# EAGLE design Controller (EAGLE 9.6.2)
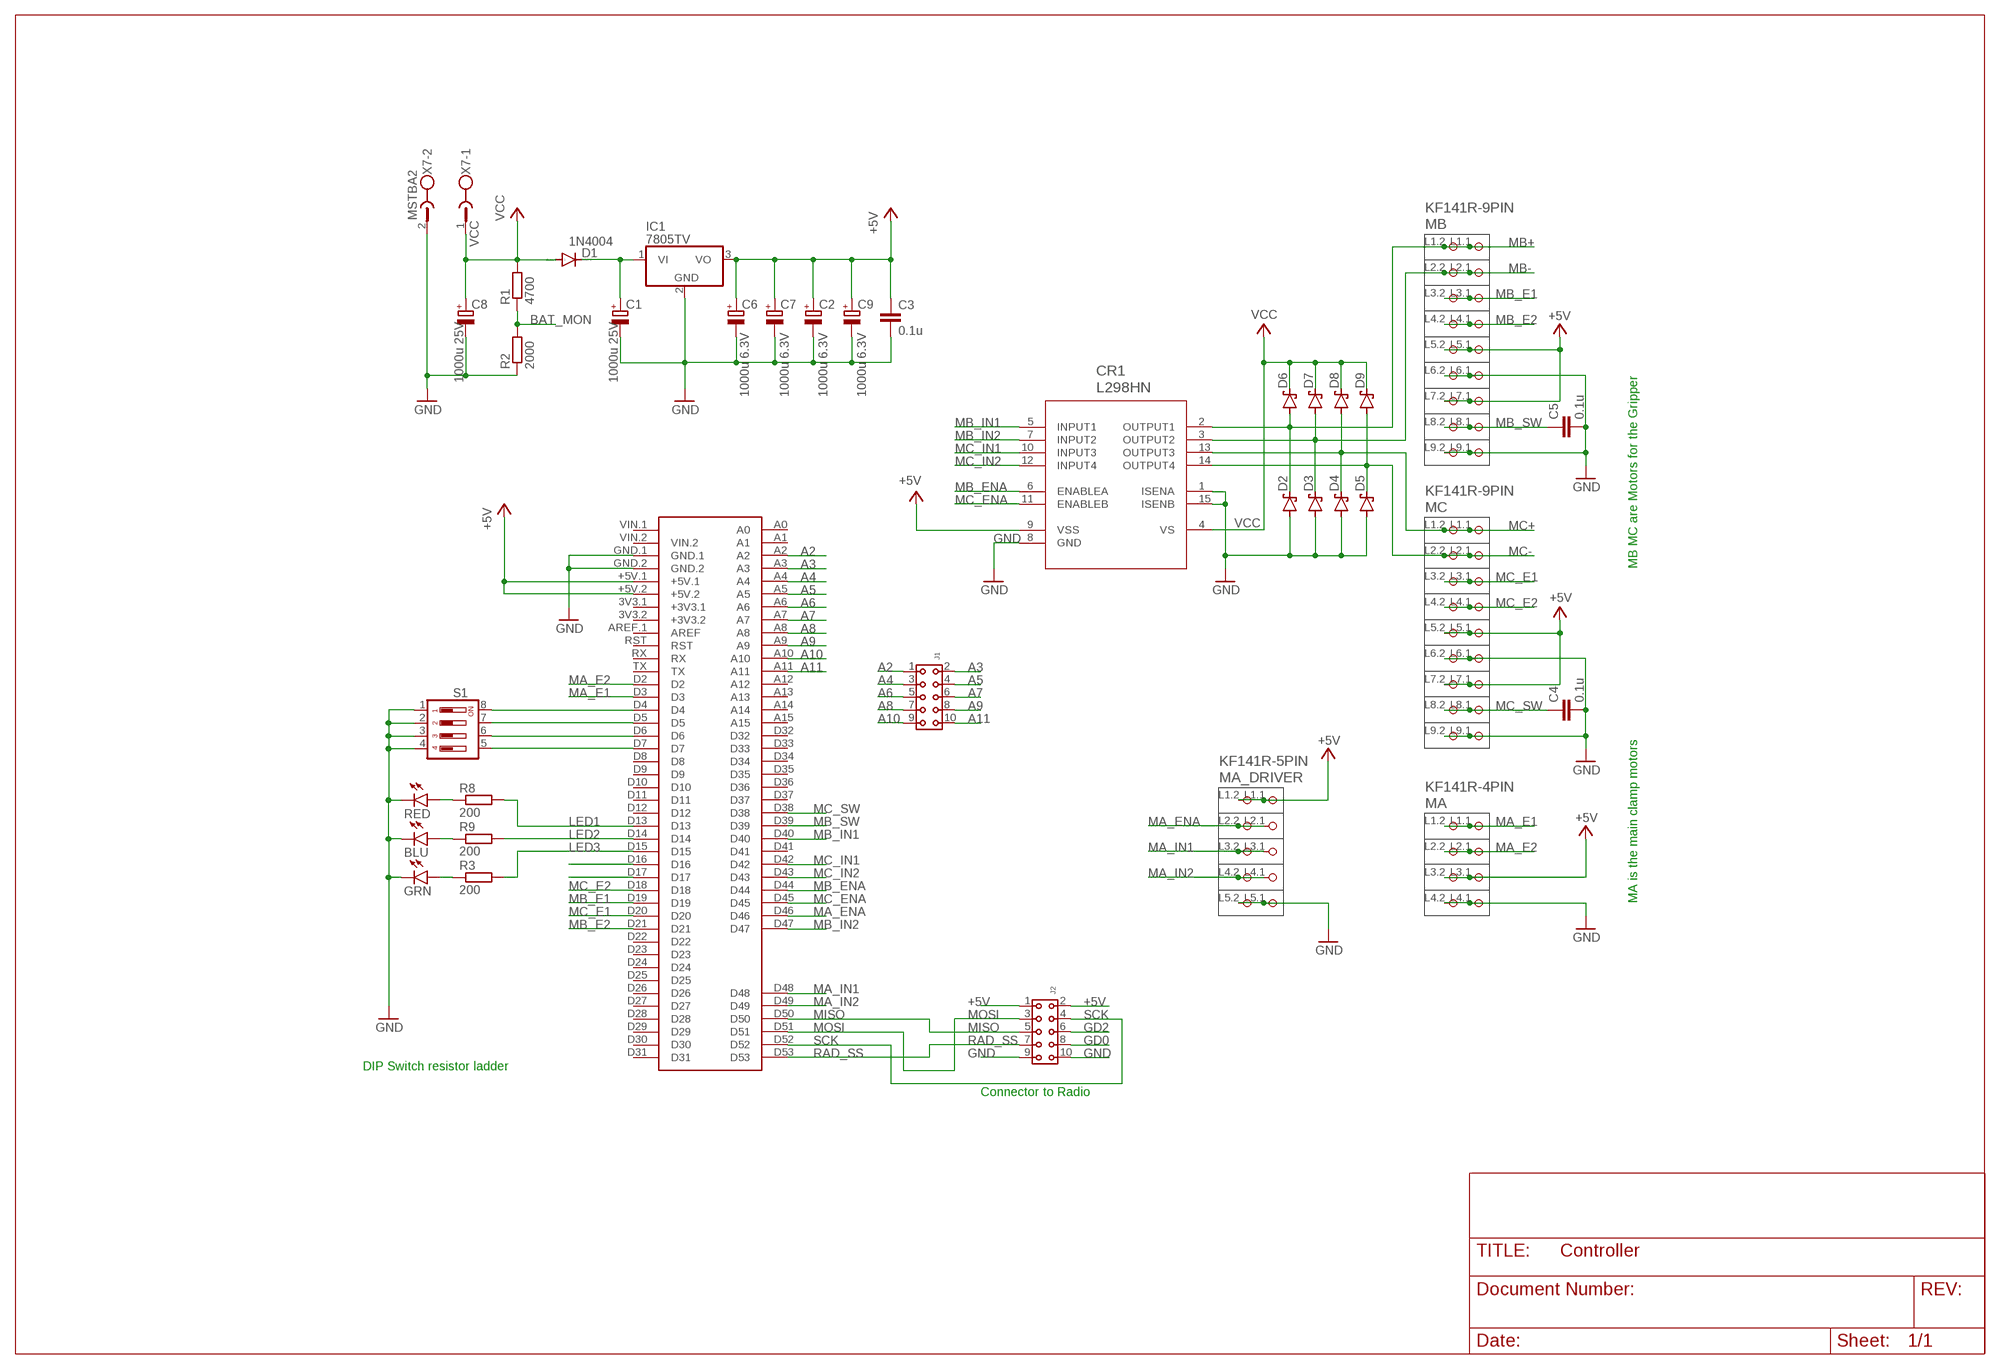
[diagram p0: schematic, sheet 1]

## Parts
BLU  LED5MM  [LED5MM]
C1  1000u 25V  CPOL-EUE3.5-10  [E3,5-10]
C2  1000u 6.3V  CPOL-EU  [E4-8-13HORI]
C3  0.1u  C-EU050-030X075  [C050-030X075]
C4  0.1u  C-EU050-030X075  [C050-030X075]
C5  0.1u  C-EU050-030X075  [C050-030X075]
C6  1000u 6.3V  CPOL-EU  [E4-8-13HORI]
C7  1000u 6.3V  CPOL-EU  [E4-8-13HORI]
C8  1000u 25V  CPOL-EUE3.5-10  [E3,5-10]
C9  1000u 6.3V  CPOL-EU  [E4-8-13HORI]
CR1  L298HN  [MULTIWATT15_H_STM]
D1  1N4004  [DO41-10]
D2  1N5819-B  [DO41-7.6]
D3  1N5819-B  [DO41-7.6]
D4  1N5819-B  [DO41-7.6]
D5  1N5819-B  [DO41-7.6]
D6  1N5819-B  [DO41-7.6]
D7  1N5819-B  [DO41-7.6]
D8  1N5819-B  [DO41-7.6]
D9  1N5819-B  [DO41-7.6]
GRN  LED5MM  [LED5MM]
IC1  7805TV  [TO220V]
J1  6130XX21821_61301021821  [61301021821]
J2  6130XX21821_61301021821  [61301021821]
MA  KF141R-4PIN  [KF141R-4PIN]
MA_DRIVER  KF141R-5PIN  [KF141R-5PIN]
MB  KF141R-9PIN  [KF141R-9PIN]
MC  KF141R-9PIN  [KF141R-9PIN]
R1  4700  R-EU_0207/7  [0207/7]
R2  2000  R-EU_0207/7  [0207/7]
R3  200  R-EU_0207/7  [0207/7]
R8  200  R-EU_0207/7  [0207/7]
R9  200  R-EU_0207/7  [0207/7]
RED  LED5MM  [LED5MM]
S1  DIP04YL  [DIP04YL]
U$1  MEGA2560_MIKRO  [MEGA2560_MIKRO]
X7  MSTBA2  [MSTBA2]

## Nets
+5V: C2.+ C3.1 C6.+ C7.+ C9.+ CR1.9(VSS) IC1.3(VO) J2.1 J2.2 MA.L3.1(P3.1) MA.L3.2(P3.2) MA_DRIVER.L1.1(P1.1) MA_DRIVER.L1.2(P1.2) MB.L5.1(P5.1) MB.L5.2(P5.2) MB.L7.1(P7.1) MB.L7.2(P7.2) MC.L5.1(P5.1) MC.L5.2(P5.2) MC.L7.1(P7.1) MC.L7.2(P7.2) U$1.+5V.1 U$1.+5V.2
A2: J1.1 U$1.A2
A3: J1.2 U$1.A3
A4: J1.3 U$1.A4
A5: J1.4 U$1.A5
A6: J1.5 U$1.A6
A7: J1.6 U$1.A7
A8: J1.7 U$1.A8
A9: J1.8 U$1.A9
A10: J1.9 U$1.A10
A11: J1.10 U$1.A11
BAT_MON: R1.1 R2.2
GD0: J2.8
GD2: J2.6
GND: BLU.K(C) C1.- C2.- C3.2 C4.2 C5.2 C6.- C7.- C8.- C9.- CR1.1(ISENA) CR1.8(GND) CR1.15(ISENB) D2.A D3.A D4.A D5.A GRN.K(C) IC1.2(GND) J2.9 J2.10 MA.L4.1(P4.1) MA.L4.2(P4.2) MA_DRIVER.L5.1(P5.1) MA_DRIVER.L5.2(P5.2) MB.L6.1(P6.1) MB.L6.2(P6.2) MB.L9.1(P9.1) MB.L9.2(P9.2) MC.L6.1(P6.1) MC.L6.2(P6.2) MC.L9.1(P9.1) MC.L9.2(P9.2) R2.1 RED.K(C) S1.1 S1.2 S1.3 S1.4 U$1.GND.1 U$1.GND.2 X7.2
LED1: R8.2 U$1.D13
LED2: R9.2 U$1.D14
LED3: R3.2 U$1.D15
MA_E1: MA.L1.1(P1.1) MA.L1.2(P1.2) U$1.D3
MA_E2: MA.L2.1(P2.1) MA.L2.2(P2.2) U$1.D2
MA_ENA: MA_DRIVER.L2.1(P2.1) MA_DRIVER.L2.2(P2.2) U$1.D46
MA_IN1: MA_DRIVER.L3.1(P3.1) MA_DRIVER.L3.2(P3.2) U$1.D48
MA_IN2: MA_DRIVER.L4.1(P4.1) MA_DRIVER.L4.2(P4.2) U$1.D49
MB+: CR1.2(OUTPUT1) D2.C D6.A MB.L1.1(P1.1) MB.L1.2(P1.2)
MB-: CR1.3(OUTPUT2) D3.C D7.A MB.L2.1(P2.1) MB.L2.2(P2.2)
MB_E1: MB.L3.1(P3.1) MB.L3.2(P3.2) U$1.D19
MB_E2: MB.L4.1(P4.1) MB.L4.2(P4.2) U$1.D21
MB_ENA: CR1.6(ENABLEA) U$1.D44
MB_IN1: CR1.5(INPUT1) U$1.D40
MB_IN2: CR1.7(INPUT2) U$1.D47
MB_SW: C5.1 MB.L8.1(P8.1) MB.L8.2(P8.2) U$1.D39
MC+: CR1.13(OUTPUT3) D4.C D8.A MC.L1.1(P1.1) MC.L1.2(P1.2)
MC-: CR1.14(OUTPUT4) D5.C D9.A MC.L2.1(P2.1) MC.L2.2(P2.2)
MC_E1: MC.L3.1(P3.1) MC.L3.2(P3.2) U$1.D20
MC_E2: MC.L4.1(P4.1) MC.L4.2(P4.2) U$1.D18
MC_ENA: CR1.11(ENABLEB) U$1.D45
MC_IN1: CR1.10(INPUT3) U$1.D42
MC_IN2: CR1.12(INPUT4) U$1.D43
MC_SW: C4.1 MC.L8.1(P8.1) MC.L8.2(P8.2) U$1.D38
MISO: J2.5 U$1.D50
MOSI: J2.3 U$1.D51
N$1: U$1.D16
N$3: C1.+ D1.C IC1.1(VI)
N$4: U$1.D17
N$5: R8.1 RED.A
N$6: BLU.A R9.1
N$8: GRN.A R3.1
N$12: S1.8 U$1.D4
N$13: S1.7 U$1.D5
N$15: S1.6 U$1.D6
N$18: S1.5 U$1.D7
RAD_SS: J2.7 U$1.D53
SCK: J2.4 U$1.D52
VCC: C8.+ CR1.4(VS) D1.A D6.C D7.C D8.C D9.C R1.2 X7.1
Unconnected: U$1.3V3.1(+3V3.1) U$1.3V3.2(+3V3.2) U$1.A0 U$1.A1 U$1.A12 U$1.A13 U$1.A14 U$1.A15 U$1.AREF.1(AREF) U$1.D8 U$1.D9 U$1.D10 U$1.D11 U$1.D12 U$1.D22 U$1.D23 U$1.D24 U$1.D25 U$1.D26 U$1.D27 U$1.D28 U$1.D29 U$1.D30 U$1.D31 U$1.D32 U$1.D33 U$1.D34 U$1.D35 U$1.D36 U$1.D37 U$1.D41 U$1.RST U$1.RX U$1.TX U$1.VIN.1 U$1.VIN.2

## Notes on the sheet
- MB MC are Motors for the Gripper
- MA is the main clamp motors
- DIP Switch resistor ladder
- Connector to Radio

## Library data of the parts
BLU GRN RED = led:LED: LED OSRAM: - CHIPLED LG R971, LG N971, LY N971, LG Q971, LY Q971, LO R971, LY R971 LH N974, LH R974 LS Q976, LO Q976, LY Q976 LO Q996 - Hyper CHIPLED LW Q18S LB Q993, LB Q99A, LB R99A - SideLED LS A670, LO A670, LY A670, LG A670, LP A670 LB A673, LV A673, LT A673, LW A673 LH A674 LY A675 LS A676, LA A676, LO A676, LY A676, LW A676 LS A679, LY A679, LG A679 - Hyper Micro SIDELED® LS Y876, LA Y876, LO Y876, LY Y876 LT Y87S - SmartLED LW L88C, LW L88S LB L89C, LB L89S, LG L890 LS L89K, LO L89K, LY L89K LS L896, LA L896, LO L896, LY L896 - TOPLED LS T670, LO T670, LY T670, LG T670, LP T670 LSG T670, LSP T670, LSY T670, LOP T670, LYG T670 LG T671, LOG T671, LSG T671 LB T673, LV T673, LT T673, LW T673 LH T674 LS T676, LA T676, LO T676, LY T676, LB T676, LH T676, LSB T676, LW T676 LB T67C, LV T67C, LT T67C, LS T67K, LO T67K, LY T67K, LW E67C LS E67B, LA E67B, LO E67B, LY E67B, LB E67C, LV E67C, LT E67C LW T67C LS T679, LY T679, LG T679 LS T770, LO T770, LY T770, LG T770, LP T770 LB T773, LV T773, LT T773, LW T773 LH T774 LS E675, LA E675, LY E675, LS T675 LS T776, LA T776, LO T776, LY T776, LB T776 LHGB T686 LT T68C, LB T68C - Hyper Mini TOPLED® LB M676 - Mini TOPLED Santana® LG M470 LS M47K, LO M47K, LY M47K Source: http://www.osram.convergy.de LUXEON: - LUMILED® LXK2-PW12-R00, LXK2-PW12-S00, LXK2-PW14-U00, LXK2-PW14-V00 LXK2-PM12-R00, LXK2-PM12-S00, LXK2-PM14-U00 LXK2-PE12-Q00, LXK2-PE12-R00, LXK2-PE12-S00, LXK2-PE14-T00, LXK2-PE14-U00 LXK2-PB12-K00, LXK2-PB12-L00, LXK2-PB12-M00, LXK2-PB14-N00, LXK2-PB14-P00, LXK2-PB14-Q00 LXK2-PR12-L00, LXK2-PR12-M00, LXK2-PR14-Q00, LXK2-PR14-R00 LXK2-PD12-Q00, LXK2-PD12-R00, LXK2-PD12-S00 LXK2-PH12-R00, LXK2-PH12-S00 LXK2-PL12-P00, LXK2-PL12-Q00, LXK2-PL12-R00 Source: www.luxeon.com KINGBRIGHT: KA-3528ASYC Source: www.kingbright.com
C1 C8 = resistor:CPOL-EU: POLARIZED CAPACITOR, European symbol
C2 C6 C7 C9 = diy-rcdevices:CPOL-EU: POLARIZED CAPACITOR, European symbol
C3-C5 = rcl:C-EU: CAPACITOR, European symbol; SPICEPREFIX: C
CR1 = L298HN:L298HN; BUILT_BY: EMA_UL_Team; MANUFACTURER_PART_NUMBER: L298HN; SOURCELIBRARY: Updates_to_database_2020-11-02; VENDOR: STMicroelectronics
D1 = diode:1N4004: DIODE general purpose rectifier, 1 A
D2-D9 = diode:1N581*: 1.0A SCHOTTKY BARRIER RECTIFIER Source: http://www.diodes.com/datasheets/ds23001.pdf
IC1 = linear:78*: Positive VOLTAGE REGULATOR Source: http://cache.national.com/ds/LM/LM78L05.pdf http://www.fairchildsemi.com/ds/LM/LM7805.pdf
J1 J2 = Wurth_Connectors_WR-PHD:6130XX21821_61301021821: WR-PHD 2.54 mm Dual Socket Header ARTICLE PROPERTIES: Pins:4;​ 6;​ 8;​ 10;​ 12;​ 14;​ 16;​ 18;​ 20;​ 22;​ 24;​ 26;​ 28;​ 30;​ 32;​ 34;​ 36;​ 40;​ 44;​ 64;​ 72 KIND PROPERTIES: Pitch：2.54 mm Quality Class:3 as per CECC 75 301-802 Rows：Dual Gender：Socket Header Type：Straight MATERIAL PROPERTIES: Insulator Material :PBT Insulator Flammability Rating:UL94 V-0 Contact Material:Copper Alloy Contact Plating:Gold Contact Type:Stamped GENERAL INFORMATION Operating Temperature:-40 up to +125 °C Compliance:Lead free / RoHS ELECTRICAL PROPERTIES: Rated Current:3 A IR 1:3 A Withstanding Voltage:500 V (AC) Contact Resistance:20 mΩ RISO:1000 MΩ CERTIFICATION UL Approval:E323964 PACKAGING PROPERTIES Packaging:Tray <https://katalog.we-online.com/media/images/v2/o57948v209%20Family_Dual_Socket_Header_WR-PHD_6130xx21821.jpg> Details see: https://katalog.we-online.com/en/em/PHD_2_54_DUAL_SOCKET_HEADER_6130XX21821 Updated by Yingchun,Shan 2019-10-21 2019 (C) Würth Elektronik; DATASHEET-URL: https://katalog.we-online.com/em/datasheet/61301021821.pdf; GENDER: Socket Header; IR: 3A; MATES: WR-PHD 2.54mm SMT Dual Pin Header/THT Angled Dual Pin Header/THT Dual Board Stacker/THT Dual Pin Header; PACKAGING: Tray; PART-NUMBER: 61301021821; PINS: 10; ROWS: Dual; TYPE: Straight
MA = diy_connector:KF141R-4PIN
MA_DRIVER = diy_connector:KF141R-5PIN
MB MC = diy_connector:KF141R-9PIN: Serie 236, Klemmenleiste für Leiterplatten 2 Lötstifte/Pol / Series 236, PCB terminal strip 2 solder pins/pole Polzahl / Pole No.: 3 Rastermaß / Pitch: 5.08 mm Bemessungsspannung / Rated Voltage: 320 V Nennstrom / Nominal Current: 24 A Leiterquerschnitt / Conductor Size: 0.08 - 2.5 mm² Anschlusstechnik / Connection Technology: CAGE CLAMP® Lötstiftlänge: / Solder Pin Length: 4 mm Leitereinführung (zur Platine) / Conductor entry angle (to PCB): 45 ° Farbe / Color: grau / gray Stand: 01.01.2012. Die jeweils aktuellen Daten zu diesem Artikel finden Sie in unserem Produktkatalog, den Sie unter www.wago.com einsehen können. As of: 01/01/2012. Please find the newest data for this article in our product catalogue, which can be viewed under www.wago.com.
R1-R3 R8 R9 = resistor:R-EU_: RESISTOR, European symbol
S1 = switch-dil:DIP04YL: DIL/CODE SWITCH; OC_FARNELL: unknown; OC_NEWARK: unknown
U$1 = MIKRO_MEGA2560:MEGA2560_MIKRO: Arduino Mega2560 pro robotDyn, create by mikroavr.com
X7 = con-phoenix-508:MSTBA2: PHOENIX; MF: FARNELL; MPN: 1757242; OC_FARNELL: 3705171; OC_NEWARK: 71C4161

## Board
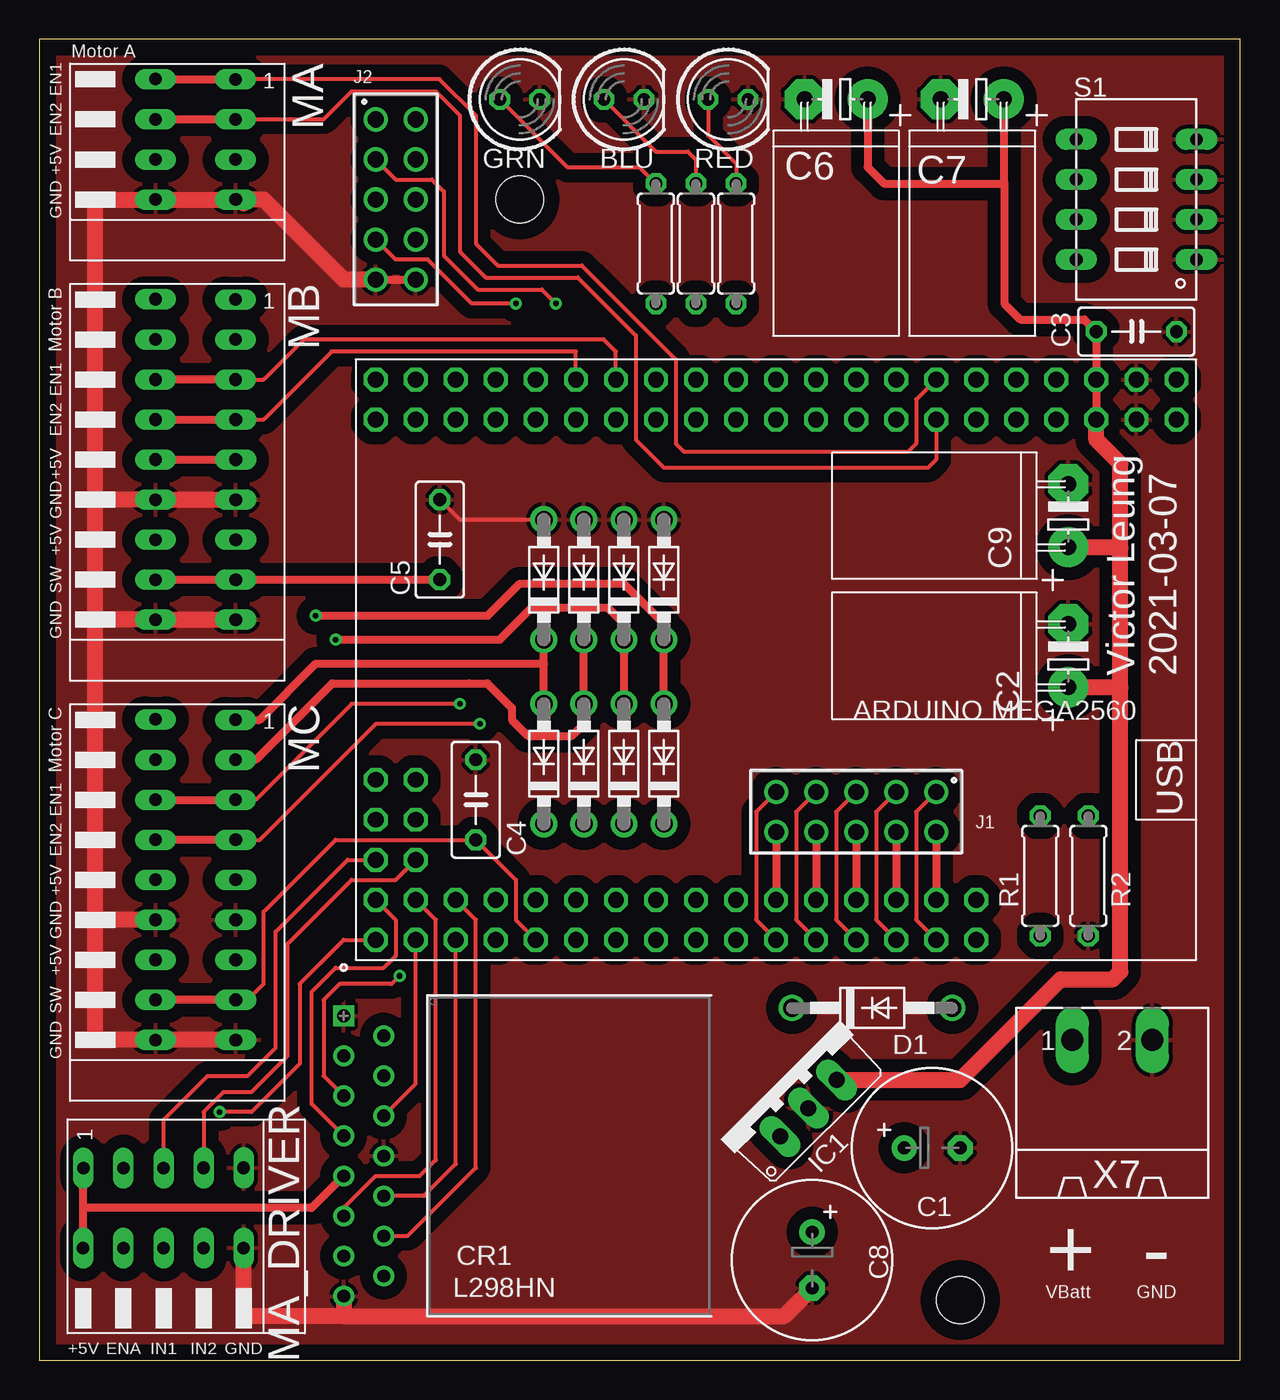
[diagram p1: board, top side]
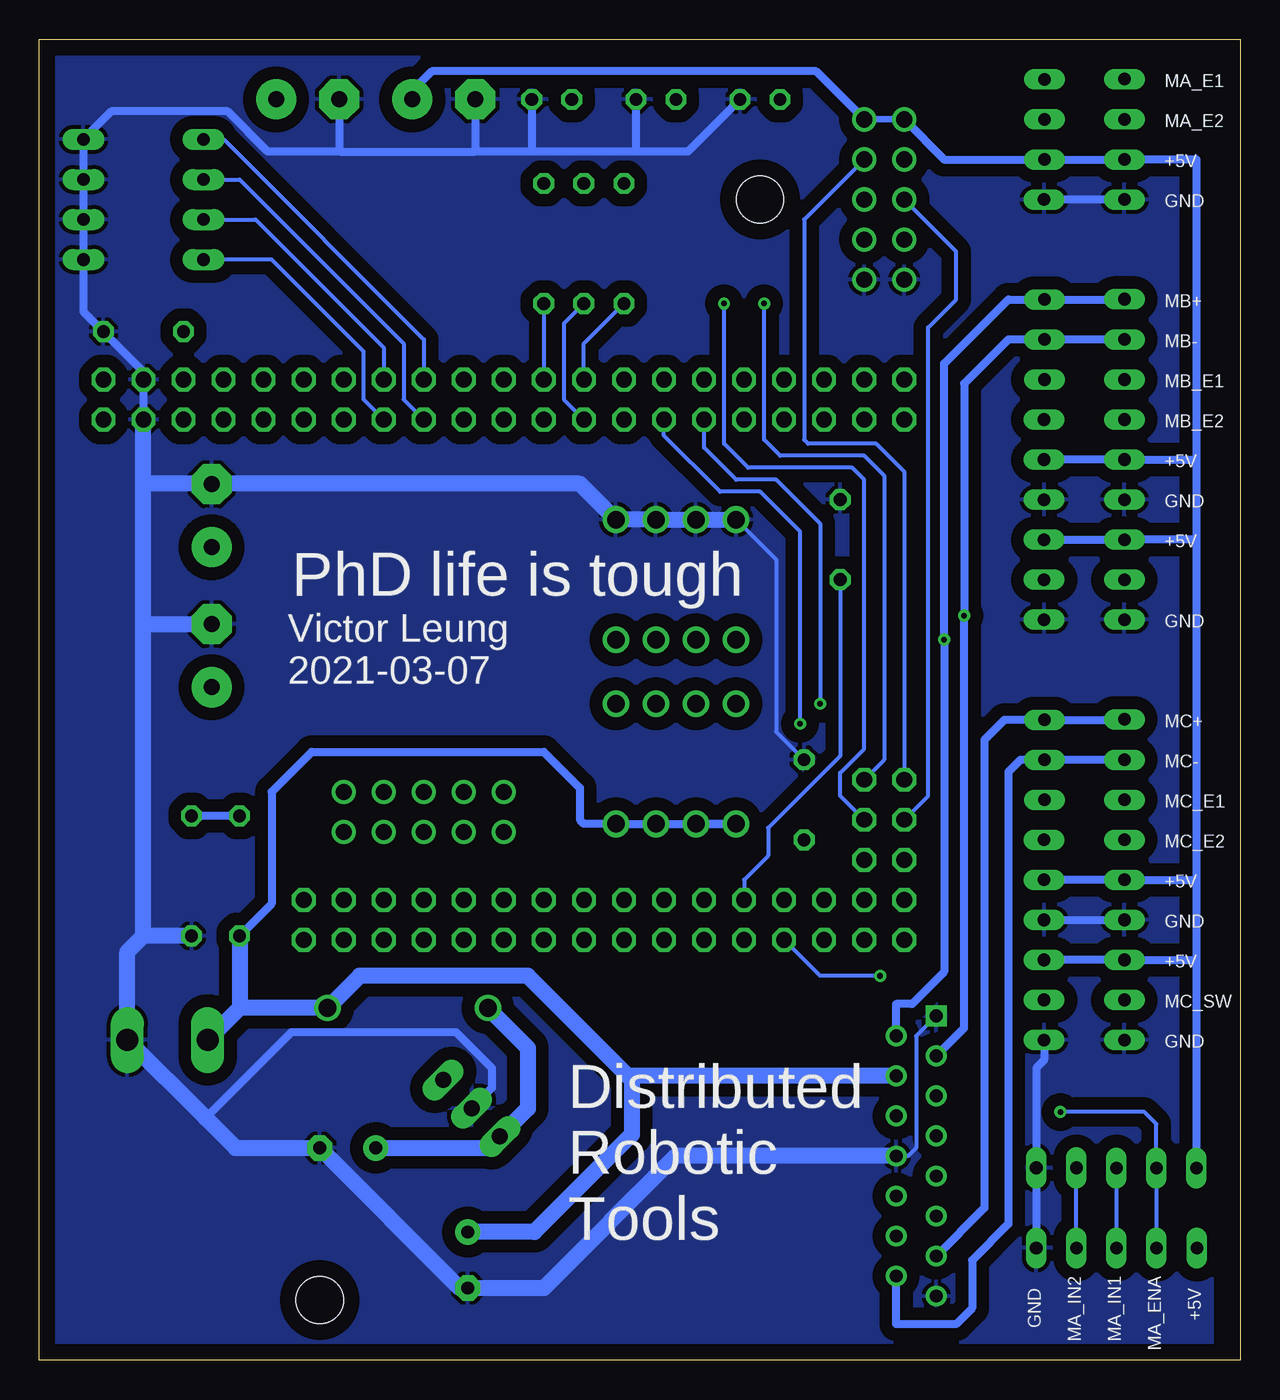
[diagram p2: board, bottom side, seen from below]

Size 76.2 x 83.82 mm. Coordinates in mm from the lower left corner, seen from the top.
Outline: 0,0 76.2,0 76.2,83.82 0,83.82 0,0
Copper layers (1*16): Top 0.035mm / dielectric 1.5mm / Bottom 0.035mm
Design rules "default": minimum track width 6mil, minimum drill 0.35mm, track to track 6mil, track to pad 6mil, pad to pad 6mil, via to via 6mil, smd to smd 6mil, copper to edge 40mil, drill to drill 6mil, minimum pad ring 10mil, minimum via ring 8mil, stop-mask expansion 4mil, vias tented up to drill 0mil, thermal gap 10mil
Holes 3 mm at 30.48,73.66 58.42,3.81

### Footprints (pad centres in the part's own frame; a part is rotated, then mirrored left to right if it is on the bottom)
LED5MM = drill 0.813 octagon: A -1.27,0; K 1.27,0
E3,5-10 = drill 0.813 pad 1.6: + -1.778,0 | drill 0.813 pad 1.6 octagon: - 1.778,0
E4-8-13HORI = drill 1.016 pad 2.54: + -2,0 | drill 1.016 pad 2.54 octagon: - 2,0
C050-030X075 = drill 0.813 octagon: 1 -2.54,0; 2 2.54,0
MULTIWATT15_H_STM = drill 0.813 pad 1.321 square: 1 0,0 | drill 0.813 pad 1.321: 2 1.27,2.54; 3 2.54,0; 4 3.81,2.54; 5 5.08,0; 6 6.35,2.54; 7 7.62,0; 8 8.89,2.54; 9 10.16,0; 10 11.43,2.54; 11 12.7,0; 12 13.97,2.54; 13 15.24,0; 14 16.51,2.54; 15 17.78,0
DO41-10 = drill 1.118: A 5.08,0; C -5.08,0
DO41-7.6 = drill 1.1 pad 1.7: A 3.81,0; C -3.81,0
TO220V = drill 1.016 long: 1 -2.54,-2.54; 2 0,-2.54; 3 2.54,-2.54
61301021821 = drill 1.02: 1 -5.08,-1.27; 2 -5.08,1.27; 3 -2.54,-1.27; 4 -2.54,1.27; 5 0,-1.27; 6 0,1.27; 7 2.54,-1.27; 8 2.54,1.27; 9 5.08,-1.27; 10 5.08,1.27
KF141R-4PIN = drill 0.8 long: L1.1 0,0; L1.2 -5.08,0.024; L2.1 0,-2.54; L2.2 -5.08,-2.54; L3.1 0,-5.08; L3.2 -5.08,-5.08; L4.1 0.009,-7.62; L4.2 -5.08,-7.62
KF141R-5PIN = drill 0.8 long: L1.1 0,0; L1.2 -5.08,0.024; L2.1 0,-2.54; L2.2 -5.08,-2.54; L3.1 0,-5.08; L3.2 -5.08,-5.08; L4.1 0.009,-7.62; L4.2 -5.08,-7.62; L5.1 0.009,-10.16; L5.2 -5.08,-10.16
KF141R-9PIN = drill 0.8 long: L1.1 0,0; L1.2 -5.08,0.024; L2.1 0,-2.54; L2.2 -5.08,-2.54; L3.1 0,-5.08; L3.2 -5.08,-5.08; L4.1 0.009,-7.62; L4.2 -5.08,-7.62; L5.1 0.009,-10.16; L5.2 -5.08,-10.16; L6.1 0.009,-12.7; L6.2 -5.08,-12.7; L7.1 0.009,-15.24; L7.2 -5.08,-15.24; L8.1 0.009,-17.78; L8.2 -5.08,-17.78; L9.1 0.009,-20.32; L9.2 -5.08,-20.32
0207/7 = drill 0.813 octagon: 1 -3.81,0; 2 3.81,0
DIP04YL = drill 0.813 long: 1 -3.81,-3.81; 2 -1.27,-3.81; 3 1.27,-3.81; 4 3.81,-3.81; 5 3.81,3.81; 6 1.27,3.81; 7 -1.27,3.81; 8 -3.81,3.81
MEGA2560_MIKRO = drill 1 octagon: 3V3.1 -26.67,-17.78; 3V3.2 -26.67,-20.32; +5V.1 -29.21,-17.78; +5V.2 -29.21,-20.32; A0 -21.59,15.24; A1 -21.59,12.7; A2 -19.05,15.24; A3 -19.05,12.7; A4 -16.51,15.24; A5 -16.51,12.7; A6 -13.97,15.24; A7 -13.97,12.7; A8 -11.43,15.24; A9 -11.43,12.7; A10 -8.89,15.24; A11 -8.89,12.7; A12 -6.35,15.24; A13 -6.35,12.7; A14 -3.81,15.24; A15 -3.81,12.7; AREF.1 -24.13,-17.78; D2 -19.05,-17.78; D3 -19.05,-20.32; D4 -16.51,-17.78; D5 -16.51,-20.32; D6 -13.97,-17.78; D7 -13.97,-20.32; D8 -11.43,-17.78; D9 -11.43,-20.32; D10 -8.89,-17.78; D11 -8.89,-20.32; D12 -6.35,-17.78; D13 -6.35,-20.32; D14 -3.81,-17.78; D15 -3.81,-20.32; D16 -1.27,-17.78; D17 -1.27,-20.32; D18 1.27,-17.78; D19 1.27,-20.32; D20 3.81,-17.78; D21 3.81,-20.32; D22 6.35,-17.78; D23 6.35,-20.32; D24 8.89,-17.78; D25 8.89,-20.32; D26 11.43,-17.78; D27 11.43,-20.32; D28 13.97,-17.78; D29 13.97,-20.32; D30 16.51,-17.78; D31 16.51,-20.32; D32 -1.27,15.24; D33 -1.27,12.7; D34 1.27,15.24; D35 1.27,12.7; D36 3.81,15.24; D37 3.81,12.7; D38 6.35,15.24; D39 6.35,12.7; D40 8.89,15.24; D41 8.89,12.7; D42 11.43,15.24; D43 11.43,12.7; D44 13.97,15.24; D45 13.97,12.7; D46 16.51,15.24; D47 16.51,12.7; D48 16.51,10.16; D49 13.97,10.16; D50 16.51,7.62; D51 13.97,7.62; D52 16.51,5.08; D53 13.97,5.08; GND.1 -31.75,-17.78; GND.2 -31.75,-20.32; RST -24.13,-20.32; RX -21.59,-17.78; TX -21.59,-20.32; VIN.1 -34.29,-17.78; VIN.2 -34.29,-20.32
MSTBA2 = drill 1.397 long: 1 -2.54,5.08; 2 2.54,5.08

### Placement (x,y rotation side)
BLU  37.08,80.01 0 top
C1  56.64,13.46 0 top
C2  65.28,44.7 90 top
C3  69.6,65.28 0 top
C4  27.69,35.56 90 top
C5  25.4,52.07 90 top
C6  50.55,80.01 180 top
C7  59.18,80.01 180 top
C8  49.02,6.35 270 top
C9  65.28,53.59 90 top
CR1  19.3,21.84 270 top
D1  52.83,22.35 0 top
D2  37.08,49.53 90 top
D3  39.62,49.53 90 top
D4  32,49.53 90 top
D5  34.54,49.53 90 top
D6  37.08,37.85 90 top
D7  39.62,37.85 90 top
D8  32,37.85 90 top
D9  34.54,37.85 90 top
GRN  30.48,80.01 0 top
IC1  46.99,17.78 45 top
J1  51.82,34.8 180 top
J2  22.61,73.66 270 top
MA  12.45,81.28 0 top
MA_DRIVER  2.79,12.19 90 top
MB  12.45,67.31 0 top
MC  12.45,40.64 0 top
R1  63.5,30.73 270 top
R2  66.55,30.73 90 top
R3  39.12,70.87 270 top
R8  44.2,70.87 270 top
R9  41.66,70.87 270 top
RED  43.69,80.01 0 top
S1  69.6,73.66 90 top
U$1  37.85,41.91 180 top
X7  68.07,15.24 0 top

### Tracks (layer width: path | path; a pad name or v marks a point on that pad's centre or on a via)
+5V
  Top 0.508: MB.L5.2 12.45,57.15 | MA_DRIVER.L1.2 2.77,9.65 | 2.77,9.65 2.77,12.17 MA_DRIVER.L1.1 | C6.+ 52.55,75.72 53.59,74.68 61.21,74.68 | 61.21,74.68 61.21,67.06 62.23,66.04 66.29,66.04 C3.1 U$1.+5V.2 U$1.+5V.1 | 61.21,74.68 61.21,79.98 C7.+ | CR1.9 17.27,9.65 2.77,9.65
  Top 1.016: IC1.3 58.42,17.78 64.8,24.16 68.1,24.16 68.58,24.64 68.58,42.67 | 68.58,42.67 68.58,51.56 | 68.58,51.56 68.58,56.9 67.06,58.42 U$1.+5V.1 | C9.+ 68.55,51.59 68.58,51.56 | C2.+ 68.55,42.7 68.58,42.67
  Bottom 0.406: J2.1 J2.2
  Bottom 0.508: 2.79,25.4 MC.L7.2 MC.L7.1 | 2.79,25.4 MA_DRIVER.L1.1 | 2.79,57.15 MB.L5.2 MB.L5.1 | 2.79,57.15 2.79,76.2 MA.L3.2 MA.L3.1 18.8,76.2 J2.1 | MB.L7.1 MB.L7.2 2.79,52.07 | MC.L5.1 MC.L5.2 2.79,30.48 | 2.79,57.15 2.79,52.07 | 2.79,52.07 2.79,30.48 | 2.79,30.48 2.79,25.4 | C6.+ 52.55,80.55 51.31,81.79 26.92,81.79 J2.2
A2
  Top 0.254: J1.1 55.63,34.8 55.63,27.94 U$1.A2
A3
  Top 0.508: J1.2 U$1.A3
A4
  Top 0.254: J1.3 53.09,34.8 53.09,27.94 U$1.A4
A5
  Top 0.508: J1.4 U$1.A5
A6
  Top 0.254: J1.5 50.55,34.8 50.55,27.94 U$1.A6
A7
  Top 0.508: J1.6 U$1.A7
A8
  Top 0.254: J1.7 48.01,34.8 48.01,27.94 U$1.A8
A9
  Top 0.508: J1.8 U$1.A9
A10
  Top 0.254: J1.9 45.47,34.8 45.47,27.94 U$1.A10
A11
  Top 0.508: J1.10 U$1.A11
BAT_MON
  Bottom 0.508: R1.1 R2.2
GND
  Top 0.254: C5.2 26.67,53.34 D4.A
  Top 0.508: MC.L9.1 MC.L9.2 7.11,20.32 3.56,20.32 | 12.95,12.7 MA_DRIVER.L5.1 | J2.9 J2.10
  Top 1.016: MA_DRIVER.L5.2 12.95,2.79 19.3,2.79 | 19.3,2.79 47.24,2.79 C8.- | MC.L9.1 7.11,20.32 | MC.L9.2 3.56,20.32 3.56,27.94 | 3.56,27.94 3.56,46.99 | 3.56,46.99 3.56,54.61 | 3.56,54.61 3.56,73.66 MA.L4.2 12.7,73.66 | 12.7,73.66 12.95,73.41 | 12.7,73.66 14.22,73.66 19.3,68.58 J2.9 | MB.L9.1 MB.L9.2 3.56,46.99 | 3.56,54.61 MB.L6.2 MB.L6.1 | MC.L6.2 3.56,27.94 | CR1.15 19.3,2.79
  Bottom 0.254: CR1.1 20.57,20.57 20.57,13.46 21.08,12.95 CR1.8 22.61,12.95 | D4.A 29.46,50.8 29.46,39.88 C4.2 | 73.03,66.17 72.26,65.41 C3.2 69.6,62.74
  Bottom 0.508: MC.L6.1 MC.L6.2 | MA.L4.2 MA.L4.1 | U$1.GND.1 U$1.GND.2 69.6,62.74 72.26,65.41 | 69.6,36.83 69.6,26.92 | 48.76,15.99 IC1.2 47.5,17.27 47.5,18.54 49.78,20.83 60.2,20.83 65.66,15.37 | MC.L9.1 12.46,19.04 12.95,18.54 MA_DRIVER.L5.1 MA_DRIVER.L5.2 | C7.- 57.18,76.74 57.15,76.71 | 57.15,76.71 61.72,76.71 64.26,79.25 71.63,79.25 S1.4 S1.3 S1.2 S1.1 73.41,66.55 73.03,66.17 C3.2 | 57.15,76.71 48.55,76.71 | C6.- 48.55,76.71 | 38.35,76.71 44.96,76.71 | 44.96,76.71 48.55,76.71 | BLU.K 38.35,76.71 | RED.K 44.96,76.71 | GRN.K 35.05,76.71 38.35,76.71
  Bottom 1.016: CR1.8 35.81,12.95 44.2,4.57 C8.- 49.53,4.57 C1.- 63.75,13.46 65.66,15.37 X7.2 70.61,25.91 69.6,26.92 | R2.1 69.6,26.92 | 69.6,26.92 69.6,46.7 | 69.6,46.7 C2.- | 69.6,46.7 69.6,55.63 | D4.A D5.A D2.A D3.A 41.91,55.63 65.25,55.63 C9.- 65.31,55.63 69.6,55.63 | 69.6,55.63 U$1.GND.1
  pour Bottom (isolate 0.813): 1.78,83.31 75.69,83.31 75.69,0.51 1.78,0.51
  pour Top (isolate 0.813): 75.18,1.02 1.02,1.02 1.02,82.8 75.18,82.8
LED1
  Bottom 0.254: R8.2 U$1.D13
LED2
  Bottom 0.254: R9.2 42.93,65.79 42.93,60.96 U$1.D14
LED3
  Bottom 0.254: U$1.D15 41.66,64.52 R3.2
MA_E1
  Top 0.254: MA.L1.2 12.42,81.3 | 12.42,81.3 MA.L1.1 | U$1.D3 55.63,60.96 55.63,58.17 55.12,57.66 40.89,57.66 40.39,58.17 40.39,63.5 34.42,69.47 29.08,69.47 27.69,70.87 27.69,78.99 25.38,81.3 12.7,81.3 12.42,81.3
  Top 0.508: MA.L1.2 12.7,81.3
MA_E2
  Top 0.254: MA.L2.1 18.03,78.74 19.81,80.52 25.15,80.52 26.67,78.99 26.67,70.36 28.32,68.71 34.16,68.71 37.85,65.02 37.85,58.42 39.62,56.64 56.39,56.64 56.9,57.15 U$1.D2
  Top 0.508: MA.L2.2 MA.L2.1
MA_ENA  (via drill 0.35)
  Top 0.254: U$1.D46 19.3,26.67 16.51,23.88 16.51,18.8 13.46,15.75 v11.43,15.75
  Bottom 0.254: v11.43,15.75 6.1,15.75 5.33,14.99 MA_DRIVER.L2.1 MA_DRIVER.L2.2
MA_IN1
  Top 0.254: MA_DRIVER.L3.1 7.87,15.24 10.67,18.03 13.21,18.03 14.99,19.81 14.99,27.18 19.56,31.75 U$1.D48
  Bottom 0.254: MA_DRIVER.L3.1 MA_DRIVER.L3.2
MA_IN2
  Top 0.254: U$1.D49 22.61,30.48 19.81,30.48 15.75,26.42 15.75,19.3 13.46,17.02 11.68,17.02 10.41,15.75 MA_DRIVER.L4.1
  Bottom 0.254: MA_DRIVER.L4.2 MA_DRIVER.L4.1
MB+  (via drill 0.35)
  Top 0.508: v18.8,45.72 29.21,45.72 31.24,47.75 36.07,47.75 37.08,46.74 D2.C D6.A
  Bottom 0.508: CR1.2 21.84,22.61 20.83,22.61 18.8,24.64 v18.8,45.72 18.8,63.25 14.73,67.31 MB.L1.1 7.39,67.31 MB.L1.2
MB-  (via drill 0.35)
  Top 0.508: v17.53,47.24 28.45,47.24 30.48,49.28 37.08,49.28 39.62,46.74 D3.C D7.A
  Bottom 0.508: CR1.3 17.53,21.08 v17.53,47.24 17.53,61.98 14.73,64.77 MB.L2.1 MB.L2.2
MB_E1
  Top 0.254: MB.L3.1 14.22,62.23 16.76,64.77 35.81,64.77 36.58,64.01 U$1.D19
  Top 0.508: MB.L3.1 MB.L3.2
MB_E2
  Top 0.254: U$1.D21 34.04,64.01 18.54,64.01 14.22,59.69 MB.L4.1
  Top 0.508: MB.L4.2 MB.L4.1
MB_ENA
  Top 0.254: CR1.6 23.88,17.53 U$1.D44
MB_IN1  (via drill 0.35)
  Top 0.254: CR1.5 18.03,18.03 18.03,22.86 19.05,23.88 22.35,23.88 v22.86,24.38
  Bottom 0.254: v22.86,24.38 26.67,24.38 U$1.D40
MB_IN2
  Top 0.254: CR1.7 17.27,16.26 17.27,23.37 18.8,24.89 21.84,24.89 22.61,25.65 22.61,27.94 U$1.D47
MB_SW
  Top 0.508: MB.L8.2 MB.L8.1 C5.1
  Bottom 0.254: C5.1 25.4,38.35 29.97,33.78 29.97,32 31.5,30.48 U$1.D39
MC+
  Top 0.508: MC.L1.1 13.97,40.64 17.53,44.2 32,44.2 | D8.A 32,44.2 | 32,44.2 D4.C
  Bottom 0.508: CR1.13 16.26,9.65 16.26,39.37 14.99,40.64 MC.L1.1 7.39,40.64 MC.L1.2
MC-
  Top 0.508: 27.25,42.95 27.27,42.93 27.43,42.93 | MC.L2.1 13.72,38.1 18.57,42.95 27.25,42.95 | 27.25,42.95 28.43,42.95 29.97,41.4 29.97,40.64 30.99,39.62 33.78,39.62 34.54,40.39 D9.A D5.C
  Bottom 0.508: CR1.14 21.84,2.29 18.03,2.29 17.02,3.3 17.02,6.35 14.73,8.64 14.73,37.34 13.97,38.1 MC.L2.1 MC.L2.2
MC_E1  (via drill 0.35)
  Top 0.254: MC.L3.1 13.72,35.56 19.81,41.66 v26.67,41.66
  Top 0.508: MC.L3.2 MC.L3.1
  Bottom 0.254: U$1.D20 34.04,57.91 32,55.88 29.46,55.88 26.67,53.09 v26.67,41.66
MC_E2  (via drill 0.35)
  Top 0.254: 13.72,33.02 MC.L4.1 13.98,33.02 21.34,40.39 v27.94,40.39
  Top 0.508: MC.L4.1 MC.L4.2
  Bottom 0.254: U$1.D18 36.58,58.67 33.02,55.12 30.48,55.12 27.94,52.58 v27.94,40.39
MC_ENA
  Top 0.254: CR1.11 19.3,9.65 21.34,11.68 24.13,11.68 25.15,12.7 25.15,27.94 U$1.D45
MC_IN1
  Top 0.254: CR1.10 24.38,10.41 26.42,12.45 U$1.D42
MC_IN2
  Top 0.254: CR1.12 23.37,7.87 27.69,12.19 27.69,27.94 U$1.D43
MC_SW
  Top 0.254: MC.L8.1 13.21,22.86 14.22,23.88 14.22,28.45 18.8,33.02 C4.1 30.23,30.48 30.23,27.94 U$1.D38
  Top 0.508: MC.L8.1 MC.L8.2
MISO
  Bottom 0.254: U$1.D50 19.81,35.81 19.81,65.53 18.03,67.31 18.03,70.36 J2.5
MOSI  (via drill 0.35)
  Top 0.254: v32.77,67.06 31.88,67.94 27.81,67.94 25.65,70.1 25.65,74.17 24.89,74.93 22.61,74.93 J2.3
  Bottom 0.254: v32.77,67.06 32.77,58.17 31.24,56.64 24.64,56.64 23.88,55.88 23.88,38.8 25.4,37.27 25.4,35.81 U$1.D51
N$3
  Bottom 1.016: C1.+ 47.75,13.46 47.01,14.2 IC1.1 45.21,15.97 45.21,19.81 D1.C
N$5
  Top 0.254: RED.A 42.42,77.72 44.2,75.95 R8.1
N$6
  Top 0.254: BLU.A 39.12,76.71 41.15,76.71 41.66,76.2 R9.1
N$8
  Top 0.254: R3.1 38.1,75.69 33.53,75.69 GRN.A
N$12
  Bottom 0.254: U$1.D4 55.63,60.96 55.63,64.01 61.47,69.85 S1.8
N$13
  Bottom 0.254: U$1.D5 54.36,64.26 62.48,72.39 S1.7
N$15
  Bottom 0.254: S1.6 63.5,74.93 53.09,64.52 53.09,60.96 U$1.D6
N$18
  Bottom 0.254: S1.5 64.52,77.47 51.82,64.77 U$1.D7
RAD_SS  (via drill 0.35)
  Top 0.254: v30.23,67.06 27.43,67.06 24.64,69.85 22.61,69.85 J2.7
  Bottom 0.254: v30.23,67.06 30.23,58.42 29.21,57.4 23.88,57.4 22.61,56.13 22.61,38.1 U$1.D53
SCK
  Bottom 0.254: J2.4 27.69,72.39 27.69,58.42 27.43,58.17 23.11,58.17 21.34,56.39 U$1.D52
VCC
  Bottom 0.508: R1.2 61.47,28.96 61.47,36.07 58.93,38.61 44.2,38.61 41.91,36.32 41.91,34.29 41.66,34.04 D7.C D6.C D8.C D9.C
  Bottom 1.016: CR1.4 38.86,18.03 | 38.86,18.03 38.61,17.78 38.61,14.32 44.8,8.13 C8.+ | 38.86,18.03 45.21,24.38 55.88,24.38 D1.A 63.5,22.35 | 63.5,22.35 X7.1 | R1.2 63.5,22.35

### Text on the board
tNames: Motor A | EN1 | EN2 | +5V | GND | Motor B | EN1 | EN2 | +5V | GND | +5V | SW | GND | Victor Leung / 2021-03-07 | Motor C | EN1 | EN2 | +5V | GND | +5V | SW | GND | + - | VBatt | GND | +5V | ENA | IN1 | IN2 | GND
bNames: MA_E1 | MA_E2 | +5V | GND | MB+ | MB- | MB_E1 | MB_E2 | +5V | GND | +5V | PhD life is tough | GND | Victor Leung / 2021-03-07 | MC+ | MC- | MC_E1 | MC_E2 | +5V | GND | +5V | MC_SW | GND | Distributed / Robotic / Tools | +5V | MA_ENA | MA_IN1 | MA_IN2 | GND